# Altium schematic sheet DC Motor Control.SchDoc
size A4; Engineer: Naif Aljohani; DocumentNumber: 6; Revision: v1.0; SheetNumber: 6; SheetTotal: 8
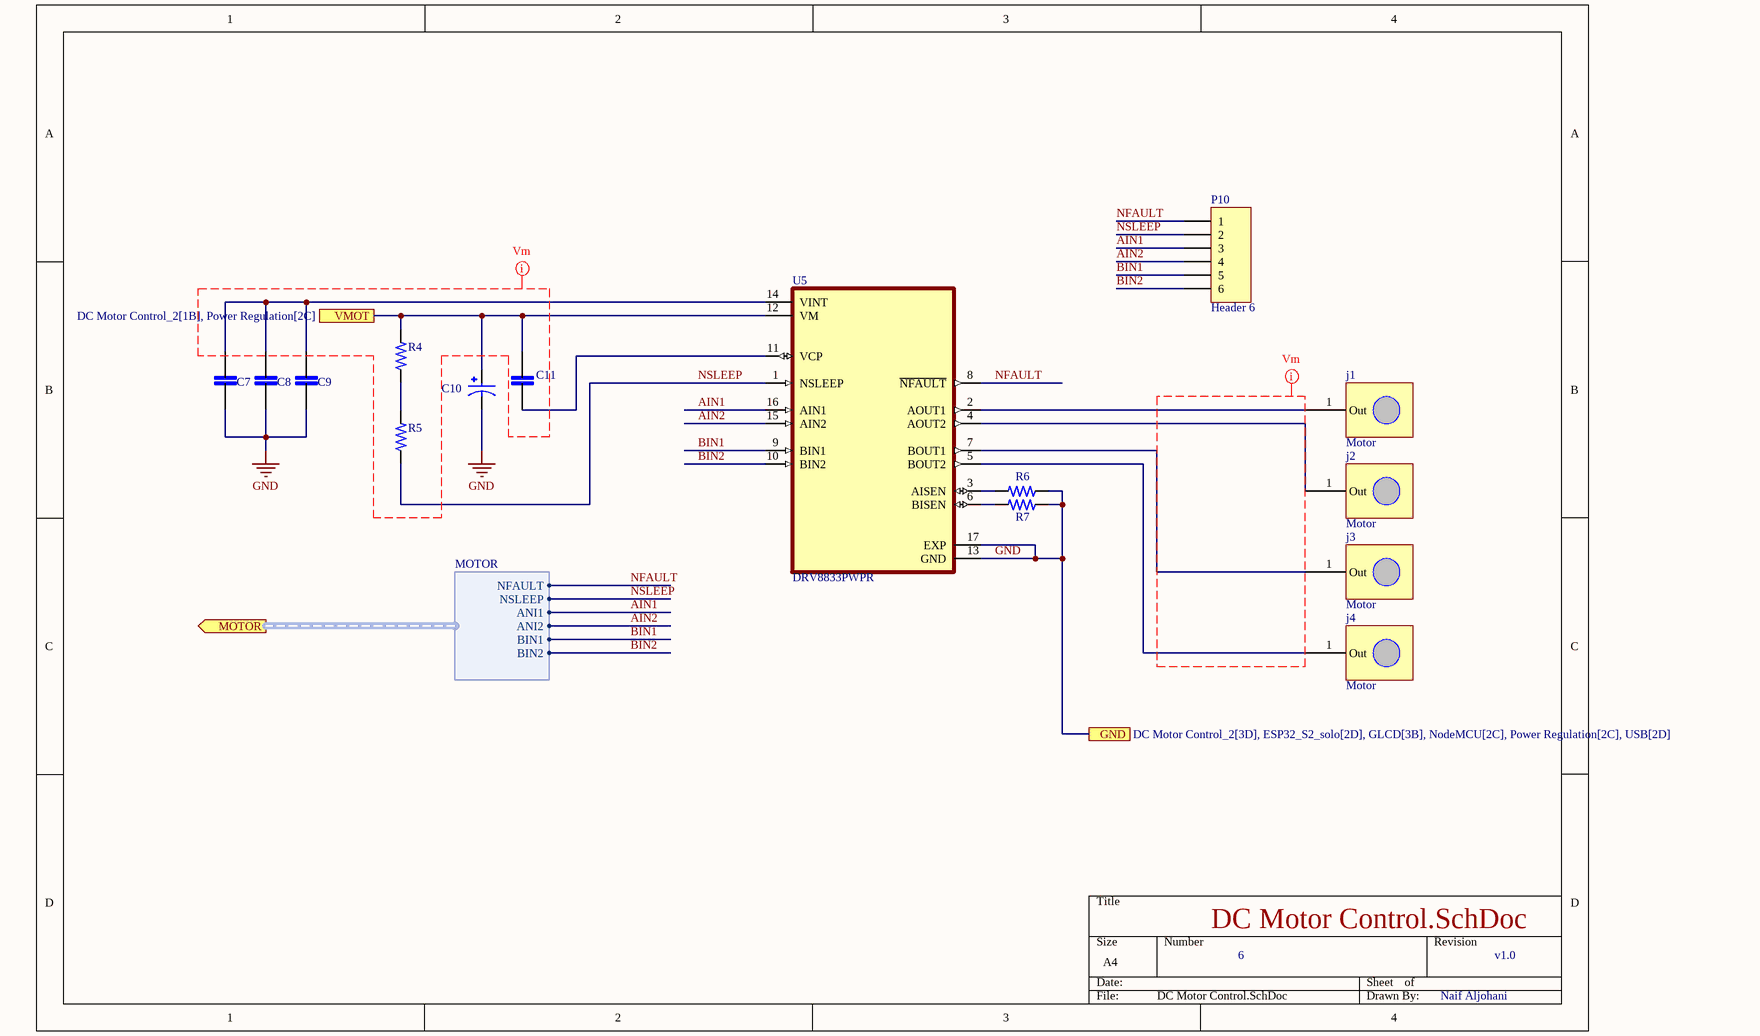
[diagram p0: DC Motor Control.SchDoc]

## Parts
C7  LD051A121KAB2A  [CAPC2012X140N]  (value not drawn)
C8  LD051A121KAB2A  [CAPC2012X140N]  (value not drawn)
C9  LD051A121KAB2A  [CAPC2012X140N]  (value not drawn)
C10  EEEHA1V101UP  [CAP_EEEHA1V101UP]  (value not drawn)
C11  LD051A121KAB2A  [CAPC2012X140N]  (value not drawn)
j1  Motor  [Motor_pin]
j2  Motor  [Motor_pin]
j3  Motor  [Motor_pin]
j4  Motor  [Motor_pin]
P10  Header 6  [HDR1X6]
R4  1-1879462-4  [RESC3115X65N]  (value not drawn)
R5  1-1879462-4  [RESC3115X65N]  (value not drawn)
R6  1-1879462-4  [RESC3115X65N]  (value not drawn)
R7  1-1879462-4  [RESC3115X65N]  (value not drawn)
U5  DRV8833PWPR  [IC_DRV8833PWPR]

## Ports
GND (see DC Motor Control_2[3D], ESP32_S2_solo[2D], GLCD[3B], NodeMCU[2C], Power Regulation[2C], USB[2D]), MOTOR (out, harness MOTOR), VMOT (see DC Motor Control_2[1B], Power Regulation[2C])

## Harnesses
MOTOR: NFAULT, NSLEEP, ANI1, ANI2, BIN1, BIN2

## Nets
GND: C7.2 C8.2 C9.2 C10.2 R6.1 R7.1 U5.13(GND) U5.17(EXP) ; port GND
AIN1: P10.3 U5.16(AIN1) ; port MOTOR.ANI1
AIN2: P10.4 U5.15(AIN2) ; port MOTOR.ANI2
BIN1: P10.5 U5.9(BIN1) ; port MOTOR.BIN1
BIN2: P10.6 U5.10(BIN2) ; port MOTOR.BIN2
NFAULT: P10.1 U5.8(~{NFAULT}) ; port MOTOR.NFAULT
NSLEEP: P10.2 R5.1 U5.1(NSLEEP) ; port MOTOR.NSLEEP
VMOT: C10.1 C11.1 R4.2 U5.12(VM) ; port VMOT
NetC7_1: C7.1 C8.1 C9.1 U5.14(VINT)
NetC11_2: C11.2 U5.11(VCP)
Netj1_1: j1.1(Out) U5.2(AOUT1)
Netj2_1: j2.1(Out) U5.4(AOUT2)
Netj3_1: j3.1(Out) U5.7(BOUT1)
Netj4_1: j4.1(Out) U5.5(BOUT2)
NetR4_1: R4.1 R5.2
NetR6_2: R6.2 U5.3(AISEN)
NetR7_2: R7.2 U5.6(BISEN)

## Layout directives
net class Vm; rule Width Constraint [Pref Width = 0.5mm    Min Width = 0.354mm    Max Width = 1mm]: (no net found under the mark)

## Library data of the parts
C7-C9 C11 = LD051A121KAB2A: 120PF 100V 10% 0805; MF: {'manufacturer': u'AVX'}; Package: None; Price: None; Value: *; MP: LD051A121KAB2A; Availability: Unavailable
C10 = EEEHA1V101UP: MF: {'manufacturer': u'Panasonic'}; Value: *; MP: EEEHA1V101UP; Availability: Unavailable; Package: None; Price: None
P10 = Header 6: Header, 6-Pin; LatestRevisionDate: 17-Jul-2002; LatestRevisionNote: Re-released for DXP Platform.; Publisher: Altium Limited
R4-R7 = 1-1879462-4: RL73H 2B R43 1% 5K RL; MF: {'manufacturer': u'TE Connectivity'}; Package: None; Price: None; Value: *; MP: 1-1879462-4; Availability: Unavailable
U5 = DRV8833PWPR: 10.8-V, 2-A dual H-bridge motor driver with current regulation 16-HTSSOP -40 to 85; MF: {'manufacturer': u'Texas Instruments'}; Package: None; Price: None; MP: DRV8833PWPR; Availability: Unavailable; Value: *